# EAGLE design LICL_Comparator (EAGLE 9.2.1)
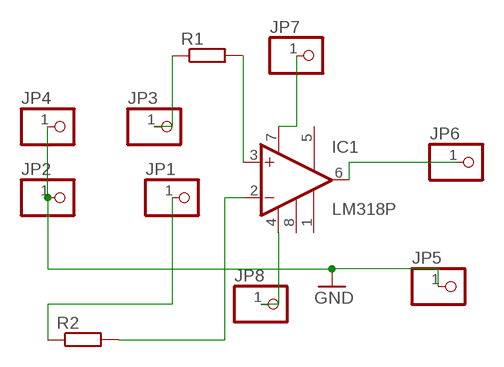
[diagram p0: schematic, sheet 1]

## Parts
IC1  LM318P  [DIL08]
JP1  PINHD-1X1  [1X01]
JP2  PINHD-1X1  [1X01]
JP3  PINHD-1X1  [1X01]
JP4  PINHD-1X1  [1X01]
JP5  PINHD-1X1  [1X01]
JP6  PINHD-1X1  [1X01]
JP7  PINHD-1X1  [1X01]
JP8  PINHD-1X1  [1X01]
R1  R-EU_0207/10  [0207/10]
R2  R-EU_0207/10  [0207/10]

## Nets
GND: JP2.1 JP4.1 JP5.1
N$1: IC1.2(-IN) R2.2
N$2: IC1.3(+IN) R1.2
N$3: JP1.1 R2.1
N$4: IC1.6(OUT) JP6.1
N$5: IC1.7(V+) JP7.1
N$6: IC1.4(V-) JP8.1
N$7: JP3.1 R1.1
Unconnected: IC1.1(BAL1) IC1.5(BAL2) IC1.8(COMP)

## Library data of the parts
IC1 = linear:LM*18: FAST GENERAL-PURPOSE OPERATIONAL AMPLIFIER Sourde: http://focus.ti.com/lit/ds/slos063b/slos063b.pdf
JP1-JP8 = pinhead:PINHD-1X1: PIN HEADER
R1 R2 = resistor:R-EU_: RESISTOR, European symbol

## Board
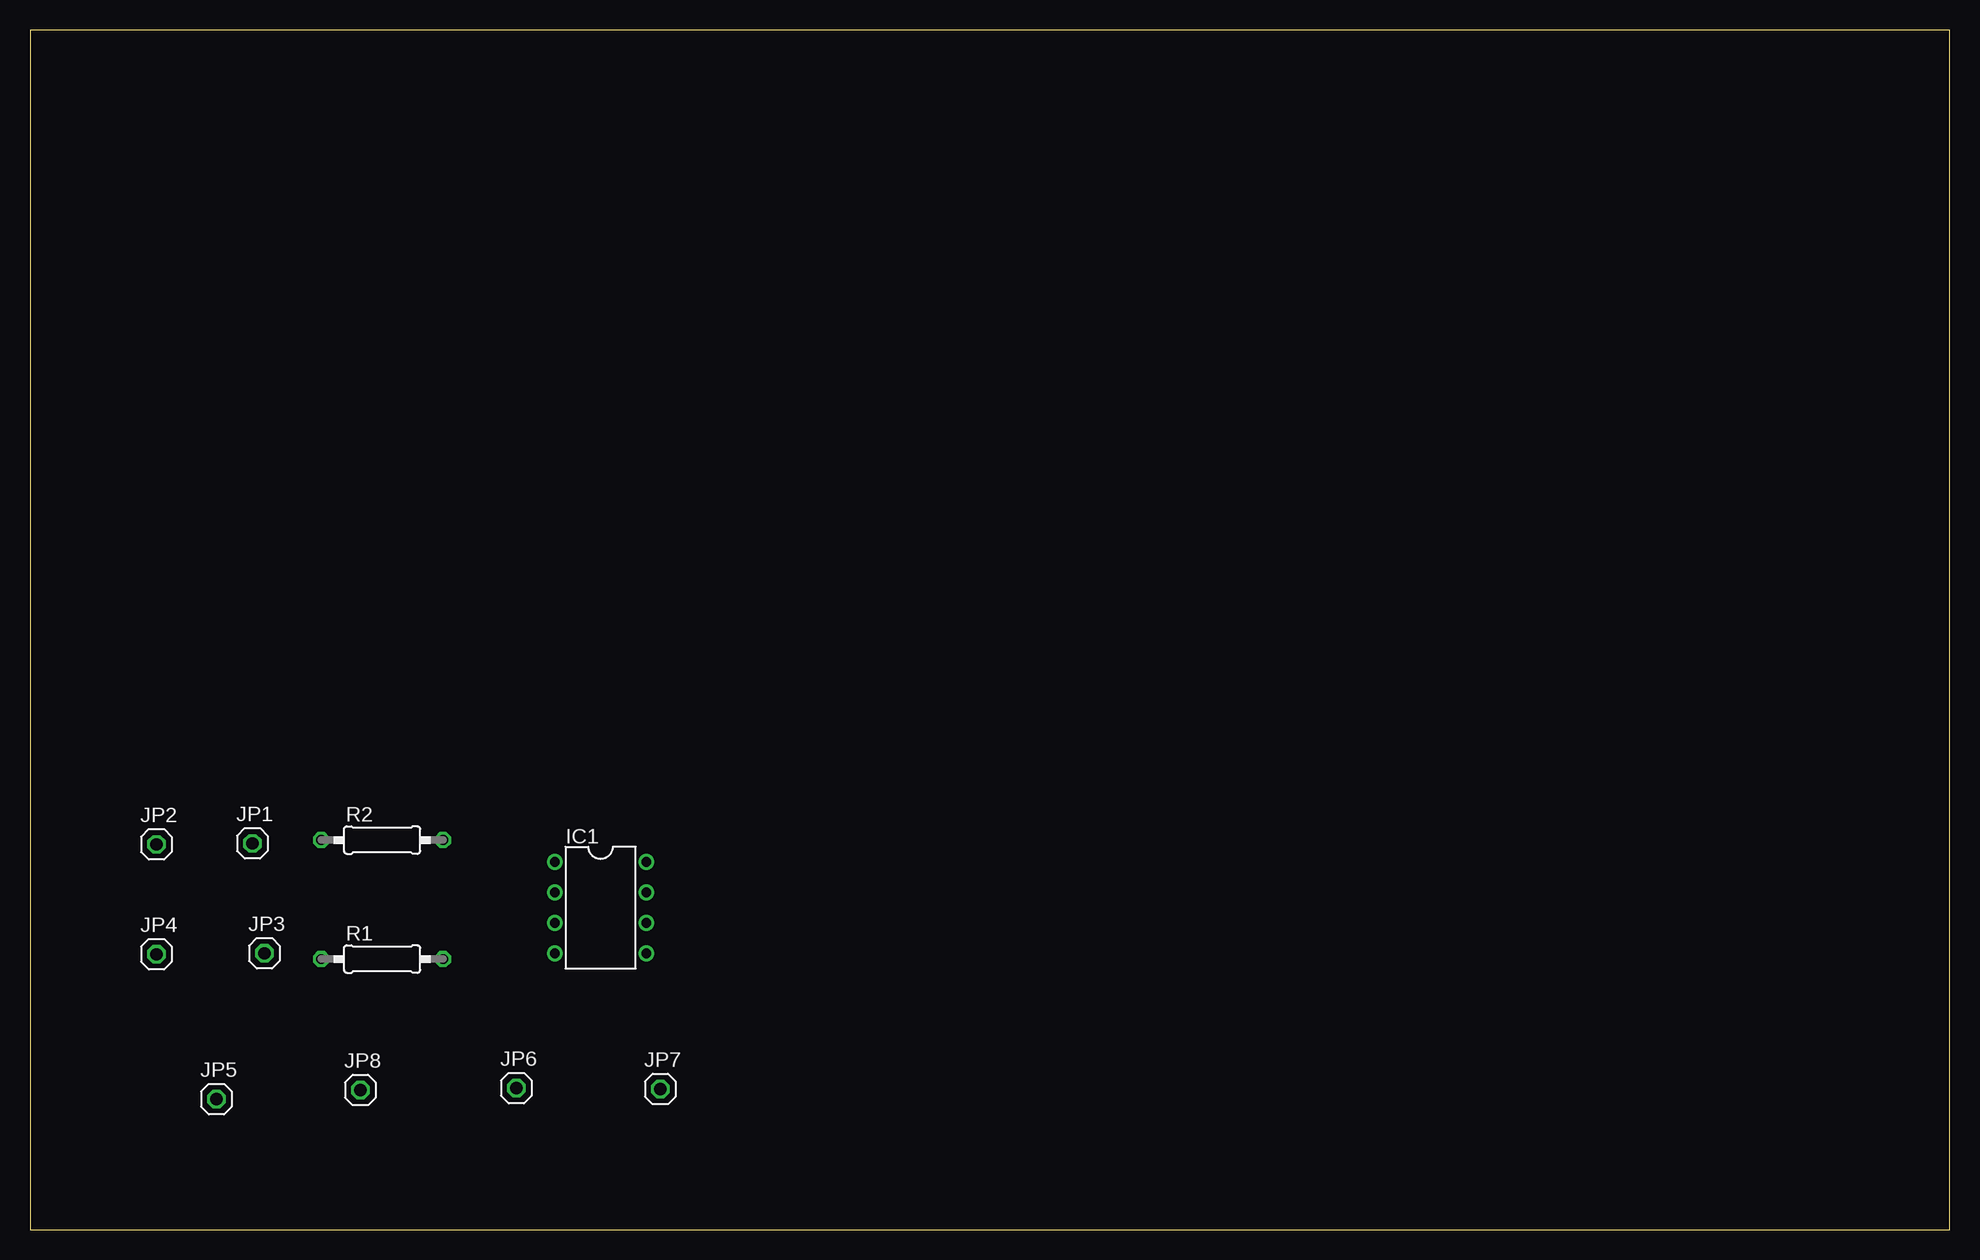
[diagram p1: board, top side]
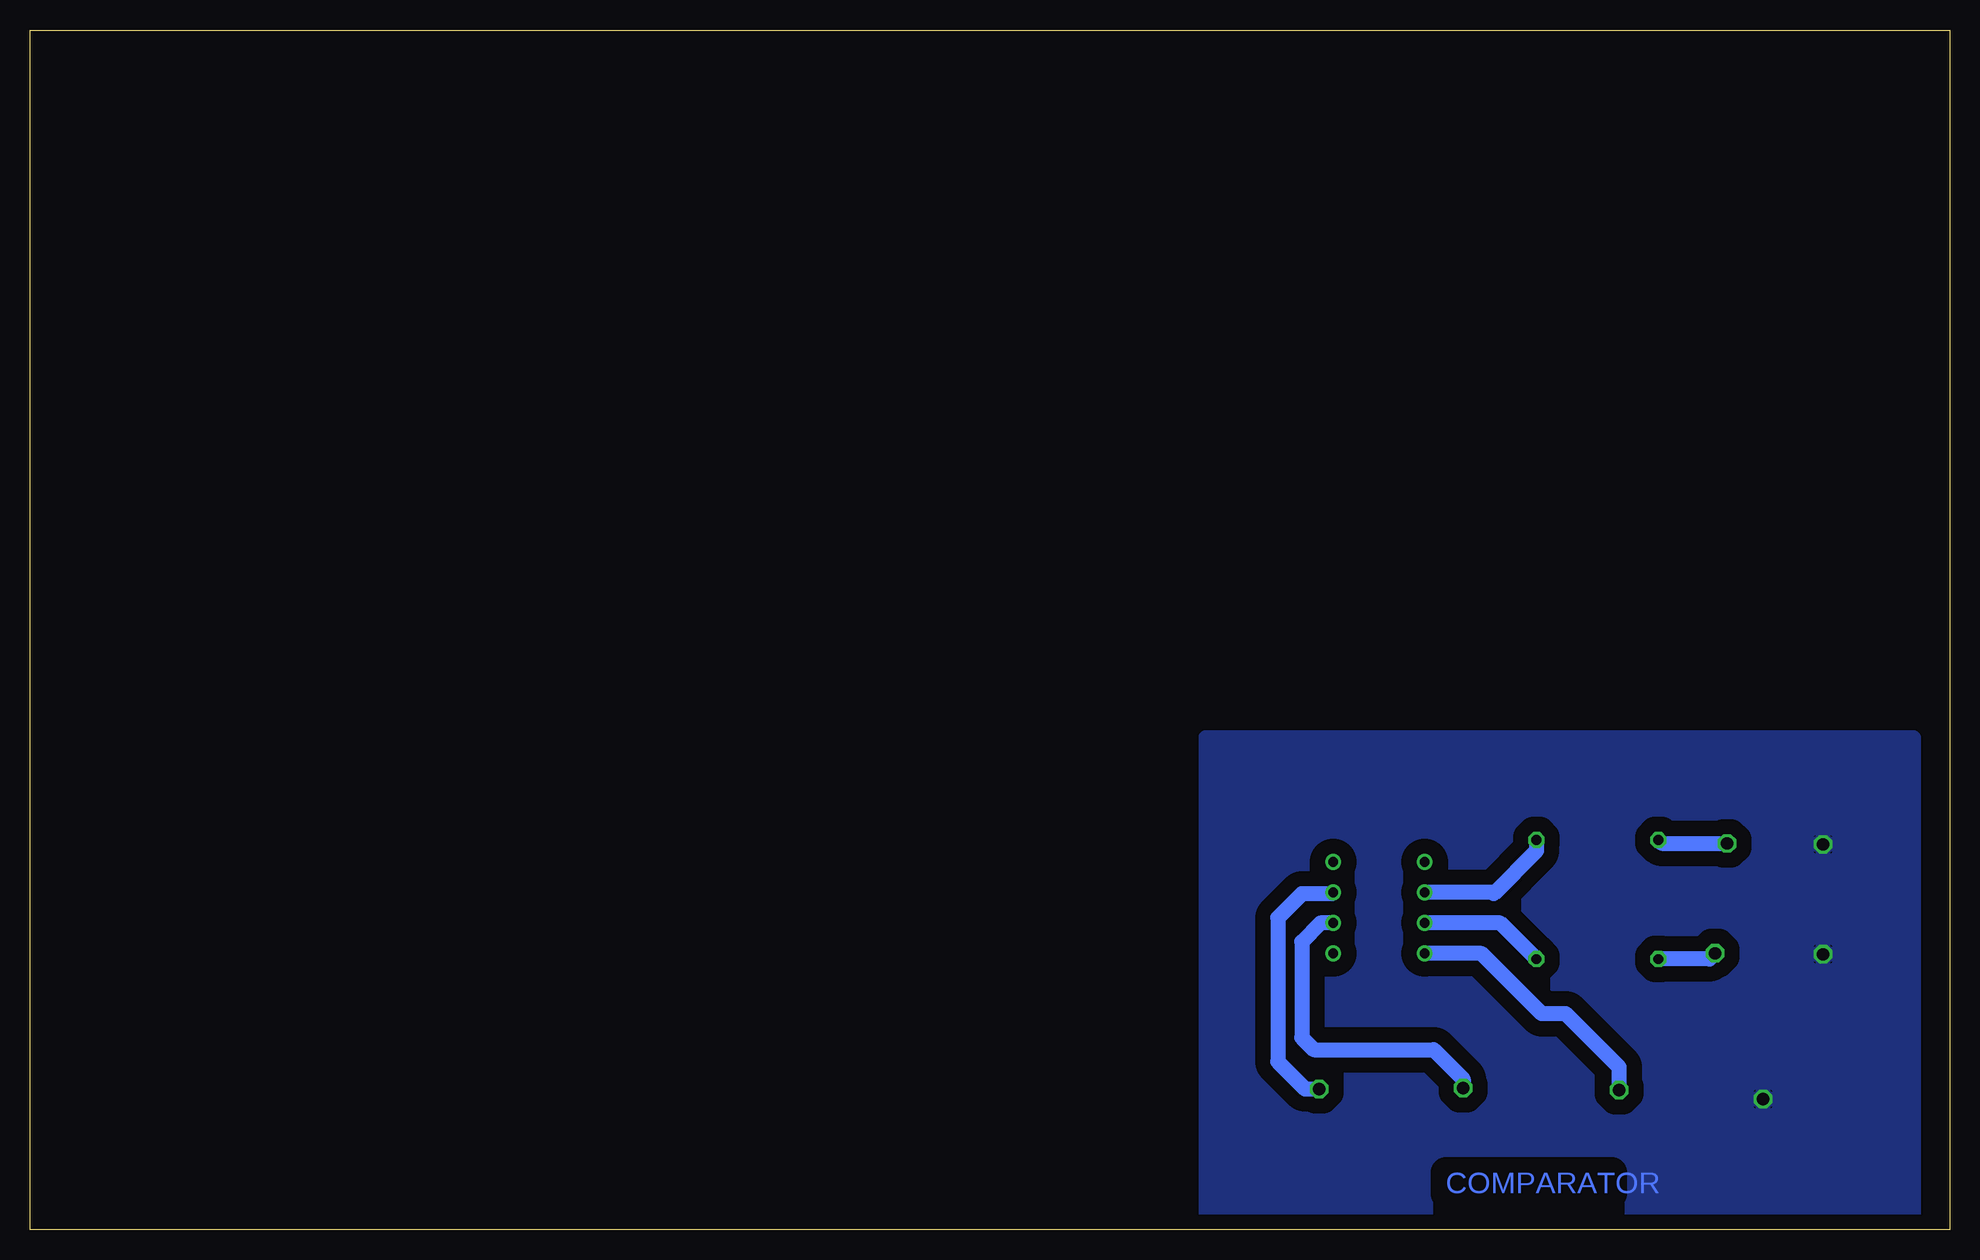
[diagram p2: board, bottom side, seen from below]

Size 160 x 100 mm. Coordinates in mm from the lower left corner, seen from the top.
Outline: 0,0 160,0 160,100 0,100 0,0
Copper layers (1*16): Top 0.035mm / dielectric 1.5mm / Bottom 0.035mm
Design rules "default": minimum track width 6mil, minimum drill 0.35mm, track to track 6mil, track to pad 6mil, pad to pad 6mil, via to via 6mil, smd to smd 6mil, copper to edge 40mil, drill to drill 6mil, minimum pad ring 10mil, minimum via ring 8mil, stop-mask expansion 4mil, vias tented up to drill 0mil, thermal gap 10mil

### Footprints (pad centres in the part's own frame; a part is rotated, then mirrored left to right if it is on the bottom)
DIL08 = drill 0.813 pad 1.27: 1 -3.81,-3.81; 2 -1.27,-3.81; 3 1.27,-3.81; 4 3.81,-3.81; 5 3.81,3.81; 6 1.27,3.81; 7 -1.27,3.81; 8 -3.81,3.81
1X01 = drill 1.016 octagon: 1 0,0
0207/10 = drill 0.813 octagon: 1 -5.08,0; 2 5.08,0

### Placement (x,y rotation side)
IC1  47.56,26.83 270 top
JP1  18.54,32.19 0 top
JP2  10.54,32.11 0 top
JP3  19.54,23.03 0 top
JP4  10.54,22.95 0 top
JP5  15.54,10.87 0 top
JP6  40.54,11.79 0 top
JP7  52.54,11.71 0 top
JP8  27.54,11.63 0 top
R1  29.35,22.55 0 top
R2  29.35,32.47 0 top

### Tracks (layer width: path | path; a pad name or v marks a point on that pad's centre or on a via)
GND
  pour Bottom (isolate 1.27): 3,0 3,41 62,41 62,0
N$1
  Bottom 1.27: R2.2 34.43,31.57 38,28 38.1,28.1 IC1.2
N$2
  Bottom 1.27: R1.2 37.44,25.56 IC1.3
N$3
  Bottom 1.27: R2.1 23.99,32.19 JP1.1
N$4
  Bottom 1.27: IC1.6 52.44,25.56 54,24 54,16 53,15 43,15 40.54,12.54 JP6.1
N$5
  Bottom 1.27: IC1.7 51.47,28 54,28 56,26 56,14 53.71,11.71 JP7.1
N$6
  Bottom 1.27: JP8.1 27.54,13.54 32,18 34,18 39.02,23.02 IC1.4
N$7
  Bottom 1.27: JP3.1 20.02,22.55 R1.1

### Text on the board
Bottom: COMPARATOR